# EAGLE schematic LDR module (EAGLE 9.1.3)
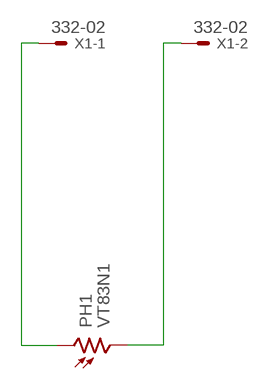
[diagram p0: schematic, sheet 1]

## Parts
PH1  VT83N1  [VT800]
X1  332-02  [332-02]

## Nets
N$1: PH1.1 X1.1
N$2: PH1.2 X1.2

## Library data of the parts
PH1 = photo-elements:VT8: Photoconductive Cell VT800 Series Source: http://optoelectronics.perkinelmer.com/content/Datasheets/DTS_vt800seriesdatasheet.pdf
X1 = con-garry:332-02: 2 Pin - 2mm Dual Row Source: www.mpe-connector.de / garry_shortform_2012.pdf